# EAGLE design _old (EAGLE 8.0.0)
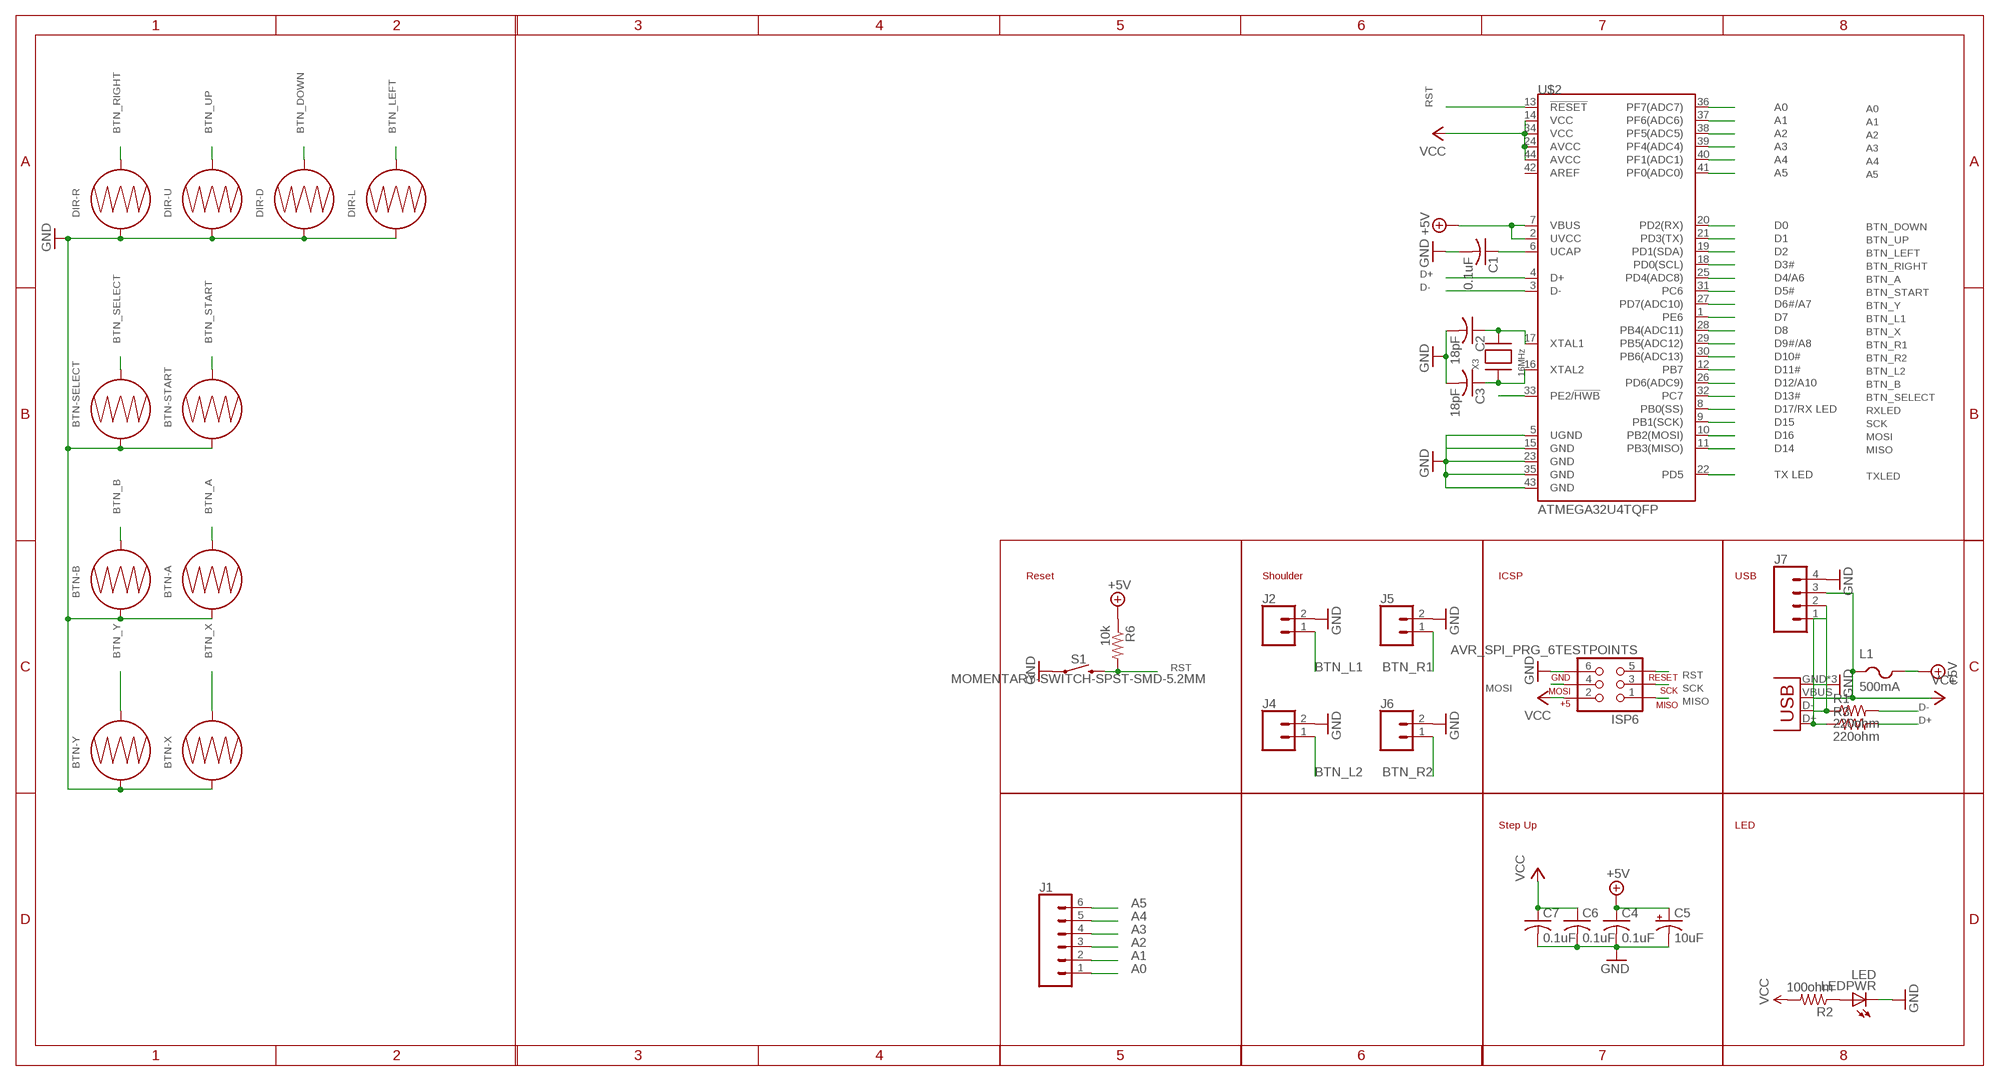
[diagram p0: schematic, sheet 1]

## Parts
BTN-A  BUTTON-CONDUCTIVESMD  [BUTTON-CONDUCTIVE]
BTN-B  BUTTON-CONDUCTIVESMD  [BUTTON-CONDUCTIVE]
BTN-SELECT  BUTTON-CONDUCTIVESMD  [BUTTON-CONDUCTIVE]
BTN-START  BUTTON-CONDUCTIVESMD  [BUTTON-CONDUCTIVE]
BTN-X  BUTTON-CONDUCTIVESMD  [BUTTON-CONDUCTIVE]
BTN-Y  BUTTON-CONDUCTIVESMD  [BUTTON-CONDUCTIVE]
C1  0.1uF  C-USC0805  [C0805]
C2  18pF  C-USC0805  [C0805]
C3  18pF  C-USC0805  [C0805]
C4  0.1uF  C-USC0805  [C0805]
C5  10uF  10UF-TANT  [EIA3216]
C6  0.1uF  C-USC0805  [C0805]
C7  0.1uF  C-USC0805  [C0805]
CN1  USB-MICROB  [USB-MICROB]
DIR-D  BUTTON-CONDUCTIVESMD  [BUTTON-CONDUCTIVE]
DIR-L  BUTTON-CONDUCTIVESMD  [BUTTON-CONDUCTIVE]
DIR-R  BUTTON-CONDUCTIVESMD  [BUTTON-CONDUCTIVE]
DIR-U  BUTTON-CONDUCTIVESMD  [BUTTON-CONDUCTIVE]
ISP6  AVR_SPI_PRG_6TESTPOINTS  [2X3_TEST_POINTS]
J1  CONN_06NO_SILK_FEMALE_PTH  [1X06_NO_SILK]
J2  CONN_021X02_NO_SILK  [1X02_NO_SILK]
J4  CONN_021X02_NO_SILK  [1X02_NO_SILK]
J5  CONN_021X02_NO_SILK  [1X02_NO_SILK]
J6  CONN_021X02_NO_SILK  [1X02_NO_SILK]
J7  CONN_041X04_NO_SILK  [1X04_NO_SILK]
L1  500mA  PTCFUSE-1206  [R1206]
LEDPWR  LED  LEDCHIPLED_0805  [CHIPLED_0805]
R1  220ohm  R-US_R0805  [R0805]
R2  100ohm  R-US_R0805  [R0805]
R3  220ohm  R-US_R0805  [R0805]
R6  10k  R-US_R0805  [R0805]
S1  MOMENTARY-SWITCH-SPST-SMD-5.2MM  [TACTILE_SWITCH_SMD_5.2MM]
U$2  ATMEGA32U4TQFP  [SPARKFUN-DIGITALIC_TQFP44]
X3  16MHz  XTALNX5032  [NX5032]

## Nets
+5V: C4.1 C5.A(+) L1.2 R6.1 U$2.2(UVCC) U$2.7(VBUS)
A0: J1.1 U$2.36(PF7(ADC7))
A1: J1.2 U$2.37(PF6(ADC6))
A2: J1.3 U$2.38(PF5(ADC5))
A3: J1.4 U$2.39(PF4(ADC4))
A4: J1.5 U$2.40(PF1(ADC1))
A5: J1.6 U$2.41(PF0(ADC0))
BTN_A: BTN-A.2 U$2.25(PD4(ADC8))
BTN_B: BTN-B.2 U$2.26(PD6(ADC9))
BTN_DOWN: DIR-D.2 U$2.20(PD2(RX))
BTN_L1: J2.1 U$2.1(PE6)
BTN_L2: J4.1 U$2.12(PB7)
BTN_LEFT: DIR-L.2 U$2.19(PD1(SDA))
BTN_R1: J5.1 U$2.29(PB5(ADC12))
BTN_R2: J6.1 U$2.30(PB6(ADC13))
BTN_RIGHT: DIR-R.2 U$2.18(PD0(SCL))
BTN_SELECT: BTN-SELECT.2 U$2.32(PC7)
BTN_START: BTN-START.2 U$2.31(PC6)
BTN_UP: DIR-U.2 U$2.21(PD3(TX))
BTN_X: BTN-X.2 U$2.28(PB4(ADC11))
BTN_Y: BTN-Y.2 U$2.27(PD7(ADC10))
D+: R3.2 U$2.4(D+)
D+IN: CN1.D+ J7.1 R3.1
D-: R1.2 U$2.3(D-)
D-IN: CN1.D- J7.2 R1.1
GND: BTN-A.1 BTN-B.1 BTN-SELECT.1 BTN-START.1 BTN-X.1 BTN-Y.1 C1.2 C2.2 C3.2 C4.2 C5.C(-) C6.2 C7.2 CN1.GND CN1.MT1(GND) CN1.MT2(GND) DIR-D.1 DIR-L.1 DIR-R.1 DIR-U.1 ISP6.6 J2.2 J4.2 J5.2 J6.2 J7.4 LEDPWR.C S1.1 U$2.5(UGND) U$2.15(GND) U$2.23(GND) U$2.35(GND) U$2.43(GND)
HWB: U$2.33(PE2/!HWB)
MISO: ISP6.1 U$2.11(PB3(MISO))
MOSI: ISP6.4 U$2.10(PB2(MOSI))
N$2: LEDPWR.A R2.1
N$8: C2.1 U$2.17(XTAL1) X3.P$2
N$9: C3.1 U$2.16(XTAL2) X3.P$1
RST: ISP6.5 R6.2 S1.3 U$2.13(!RESET)
RXLED: U$2.8(PB0(SS))
SCK: ISP6.3 U$2.9(PB1(SCK))
TXLED: U$2.22(PD5)
UCAP: C1.1 U$2.6(UCAP)
VCC: C6.1 C7.1 CN1.VBUS ISP6.2 J7.3 L1.1 R2.2 U$2.14(VCC) U$2.24(AVCC) U$2.34(VCC) U$2.44(AVCC)
Unconnected: U$2.42(AREF)

## Notes on the sheet
- Reset | Shoulder | ICSP | USB
- Step Up | LED

## Library data of the parts
BTN-A BTN-B BTN-SELECT BTN-START BTN-X BTN-Y DIR-D DIR-L DIR-R DIR-U = SparkFun-Electromechanical:BUTTON-CONDUCTIVE: Used with rubber key pads. This one was designed and proven to work with the PolyCase Key FOB enclosures.
C1-C4 C6 C7 = adafruit:C-US: CAPACITOR, American symbol
C5 = SparkFun-Retired:10UF-TANT: 10uF Tantalum SMT CAP-00811- 16V 10% (EIA-3216); PROD_ID: CAP-00811
CN1 = SparkFun-Connectors:USB: USB Connectors USB-B-PTH is fully proven SKU : PRT-00139/CONN-08278 USB-miniB is fully proven SKU : PRT-00587 USB-A-PCB is untested. USB-A-H is throughly reviewed, but untested. Spark Fun Electronics SKU : PRT-00437 USB-B-SMT is throughly reviewed, but untested. Needs silkscreen touching up. USB-A-S has not been used/tested USB-MB-H has not been used/tested USB-MICROB has been used. CONN-09505; PROD_ID: CONN-09505
ISP6 = SparkFun-Connectors:AVR_SPI_PRG_6: AVR ISP 6 Pin This is the reduced ISP connector for AVR programming. Common on Arduino. This footprint will take up less PCB space and can be used with a 10-pin to 6-pin adapter such as SKU: BOB-08508 **Special note about "TEST_POINT" package. The stop mask is on the top side, so if you want your programming test points to be on the bottom of your board, make sure to place this package on the bottom side of the board. This also ensure that the orientation to program from the bottom side will be correct.
J1 = SparkFun-Connectors:CONN_06: Multi connection point. Often used as Generic Header-pin footprint for 0.1 inch spaced/style header connections On any of the 0.1 inch spaced packages, you can populate with these: Break Away Headers - Straight <https://www.sparkfun.com/products/116> (PRT-00116) Break Away Male Headers - Right Angle <https://www.sparkfun.com/products/553> (PRT-00553) Female Headers <https://www.sparkfun.com/products/115> (PRT-00115) Break Away Headers - Machine Pin <https://www.sparkfun.com/products/117> (PRT-00117) Break Away Female Headers - Swiss Machine Pin <https://www.sparkfun.com/products/743> (PRT-00743) Arduino Stackable Header - 6 Pin <https://www.sparkfun.com/products/9280> (PRT-09280) For SCREWTERMINALS and SPRING TERMINALS visit here: Screw Terimnals on SparkFun.com <https://www.sparkfun.com/search/results?term=Screw+Terminals> (5mm/3.5mm/2.54mm spacing) This device is also useful as a general connection point to wire up your design to another part of your project. Our various solder wires solder well into these plated through hole pads. Hook-Up Wire - Assortment (Stranded, 22 AWG) <https://www.sparkfun.com/products/11375> (PRT-11375) Hook-Up Wire - Assortment (Solid Core, 22 AWG) <https://www.sparkfun.com/products/11367> (PRT-11367) View the entire wire category on our website here <https://www.sparkfun.com/categories/141>; PROD_ID: CONN-08437
J2 J4-J6 = SparkFun-Connectors:CONN_02: Multi connection point. Often used as Generic Header-pin footprint for 0.1 inch spaced/style header connections On any of the 0.1 inch spaced packages, you can populate with these: Break Away Headers - Straight <https://www.sparkfun.com/products/116> (PRT-00116) Break Away Male Headers - Right Angle <https://www.sparkfun.com/products/553> (PRT-00553) Female Headers <https://www.sparkfun.com/products/115> (PRT-00115) Break Away Headers - Machine Pin <https://www.sparkfun.com/products/117> (PRT-00117) Break Away Female Headers - Swiss Machine Pin <https://www.sparkfun.com/products/743> (PRT-00743) For SCREWTERMINALS and SPRING TERMINALS visit here: Screw Terimnals on SparkFun.com <https://www.sparkfun.com/search/results?term=Screw+Terminals> (5mm/3.5mm/2.54mm spacing) This device is also useful as a general connection point to wire up your design to another part of your project. Our various solder wires solder well into these plated through hole pads. Hook-Up Wire - Assortment (Stranded, 22 AWG) <https://www.sparkfun.com/products/11375> (PRT-11375) Hook-Up Wire - Assortment (Solid Core, 22 AWG) <https://www.sparkfun.com/products/11367> (PRT-11367) View the entire wire category on our website here <https://www.sparkfun.com/categories/141> Special notes: Molex polarized connector foot print use with: PRT-08233 with associated crimp pins and housings. 2.54_SCREWTERM for use with PRT-10571. 3.5mm Screw Terminal footprints for PRT-08084 5mm Screw Terminal footprints for use with PRT-08432
J7 = SparkFun-Connectors:CONN_04: Multi connection point. Often used as Generic Header-pin footprint for 0.1 inch spaced/style header connections On any of the 0.1 inch spaced packages, you can populate with these: Break Away Headers - Straight <https://www.sparkfun.com/products/116> (PRT-00116) Break Away Male Headers - Right Angle <https://www.sparkfun.com/products/553> (PRT-00553) Female Headers <https://www.sparkfun.com/products/115> (PRT-00115) Break Away Headers - Machine Pin <https://www.sparkfun.com/products/117> (PRT-00117) Break Away Female Headers - Swiss Machine Pin <https://www.sparkfun.com/products/743> (PRT-00743) For SCREWTERMINALS and SPRING TERMINALS visit here: Screw Terimnals on SparkFun.com <https://www.sparkfun.com/search/results?term=Screw+Terminals> (5mm/3.5mm/2.54mm spacing) This device is also useful as a general connection point to wire up your design to another part of your project. Our various solder wires solder well into these plated through hole pads. Hook-Up Wire - Assortment (Stranded, 22 AWG) <https://www.sparkfun.com/products/11375> (PRT-11375) Hook-Up Wire - Assortment (Solid Core, 22 AWG) <https://www.sparkfun.com/products/11367> (PRT-11367) View the entire wire category on our website here <https://www.sparkfun.com/categories/141> Special notes: Molex polarized connector foot print use with SKU : PRT-08231 with associated crimp pins and housings. 1MM SMD Version SKU: PRT-10208; PROD_ID: CONN-09696
L1 = adafruit:PTCFUSE: PTC fuses, resettable thermistors
LEDPWR = adafruit:LED: LED OSRAM: - CHIPLED LG R971, LG N971, LY N971, LG Q971, LY Q971, LO R971, LY R971 LH N974, LH R974 LS Q976, LO Q976, LY Q976 LO Q996 - Hyper CHIPLED LW Q18S LB Q993, LB Q99A, LB R99A - SideLED LS A670, LO A670, LY A670, LG A670, LP A670 LB A673, LV A673, LT A673, LW A673 LH A674 LY A675 LS A676, LA A676, LO A676, LY A676, LW A676 LS A679, LY A679, LG A679 - Hyper Micro SIDELED® LS Y876, LA Y876, LO Y876, LY Y876 LT Y87S - SmartLED LW L88C, LW L88S LB L89C, LB L89S, LG L890 LS L89K, LO L89K, LY L89K LS L896, LA L896, LO L896, LY L896 - TOPLED LS T670, LO T670, LY T670, LG T670, LP T670 LSG T670, LSP T670, LSY T670, LOP T670, LYG T670 LG T671, LOG T671, LSG T671 LB T673, LV T673, LT T673, LW T673 LH T674 LS T676, LA T676, LO T676, LY T676, LB T676, LH T676, LSB T676, LW T676 LB T67C, LV T67C, LT T67C, LS T67K, LO T67K, LY T67K, LW E67C LS E67B, LA E67B, LO E67B, LY E67B, LB E67C, LV E67C, LT E67C LW T67C LS T679, LY T679, LG T679 LS T770, LO T770, LY T770, LG T770, LP T770 LB T773, LV T773, LT T773, LW T773 LH T774 LS E675, LA E675, LY E675, LS T675 LS T776, LA T776, LO T776, LY T776, LB T776 LHGB T686 LT T68C, LB T68C - Hyper Mini TOPLED® LB M676 - Mini TOPLED Santana® LG M470 LS M47K, LO M47K, LY M47K Source: http://www.osram.convergy.de/
R1-R3 R6 = adafruit:R-US_: RESISTOR, American symbol
S1 = SparkFun-Switches:MOMENTARY-SWITCH-SPST: Momentary Switch (Pushbutton) - SPST Normally-open (NO) SPST momentary switches (buttons, pushbuttons). Variants PTH-12MM - 12mm square, through-hole Momentary Pushbutton Switch - 12mm Square <https://www.sparkfun.com/products/9190> (COM-09190) PTH-6.0MM, PTH-6.0MM-KIT - 6.0mm square, through-hole Mini Pushbutton Switch <https://www.sparkfun.com/products/97> (COM-00097) KIT package intended for soldering kit's - only one side of pads' copper is exposed. PTH-RIGHT-ANGLE-KIT - Right-angle, through-hole Right Angle Tactile Button <https://www.sparkfun.com/products/10791> - Used on SparkFun BigTime Watch Kit <https://www.sparkfun.com/products/11734> SMD-12MM - 12mm square, surface-mount Tactile Button - SMD (12mm) <https://www.sparkfun.com/products/12993> (COM-12993) Used on SparkFun PicoBoard <https://www.sparkfun.com/products/11888> SMD-4.5MM - 4.5mm Square Trackball Switch Used on SparkFun Blackberry Trackballer Breakout <https://www.sparkfun.com/products/13169> SMD-4.6MMX2.8MM - 4.60mm x 2.80mm, surface mount Used on SparkFun SAMD21 Mini Breakout <https://www.sparkfun.com/products/13664> SMD-5.2MM, SMD-5.2-REDUNDANT - 5.2mm square, surface-mount Mini Pushbutton Switch - SMD <https://www.sparkfun.com/products/8720> (COM-08720) Used on Arduino Pro Mini <https://www.sparkfun.com/products/11114> REDUNDANT package connects both switch circuits together SMD-6.0X3.5MM - 6.0 x 3.5mm, surface mount Momentary Reset Switch SMD <https://www.sparkfun.com/products/8229> (COM-08229) SMD-6.2MM-TALL - 6.2mm square, surface mount Tactile Button - SMD (6mm) <https://www.sparkfun.com/products/12992> Used on SparkFun Digital Sandbox <https://www.sparkfun.com/products/12651> SMD-RIGHT-ANGLE - Right-angle, surface mount Used on SparkFun Block for Intel® Edison - Arduino <https://www.sparkfun.com/products/13036>; PROD_ID: SWCH-08247; SF_SKU: COM-08720
U$2 = SparkFun-Retired:ATMEGA32U4: Atmel 44-pin 8-bit Microcontroller with 32KBytes of ISP Flash and USB Controller ----- Please use the QFN-44-NOPAD_1:1 package for the footprint of all boards using a 32U4. Route traces directly away from the pads as much as possible.; PROD_ID: IC-11161
X3 = adaprog:XTAL

## Board
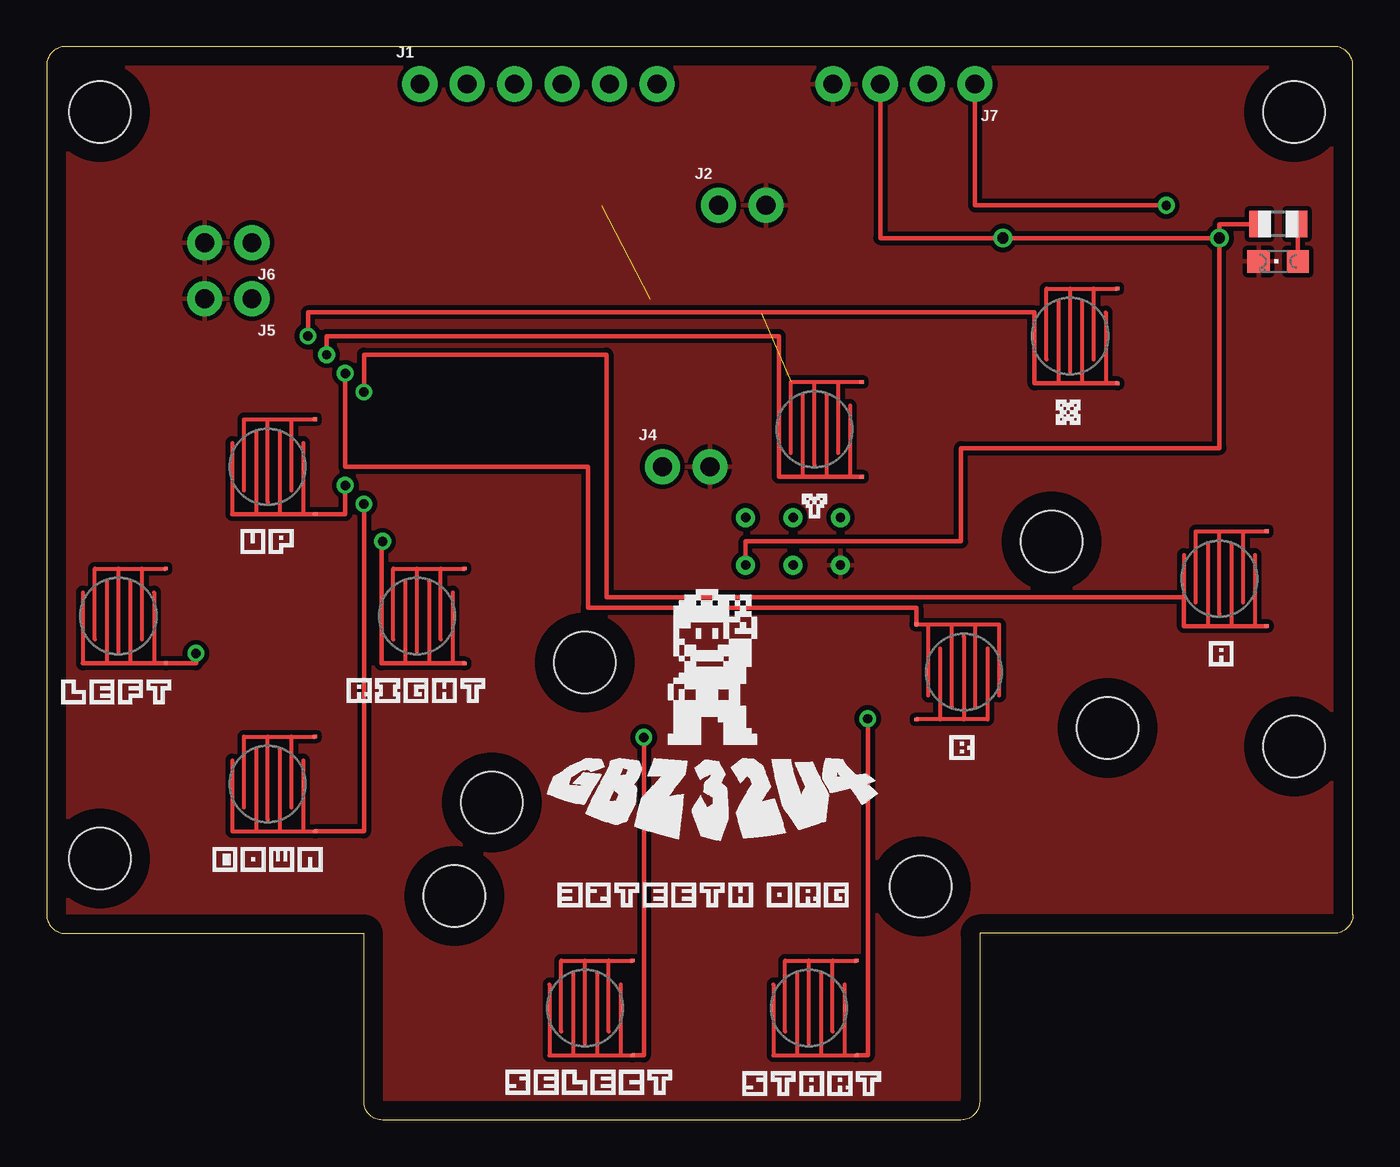
[diagram p1: board, top side]
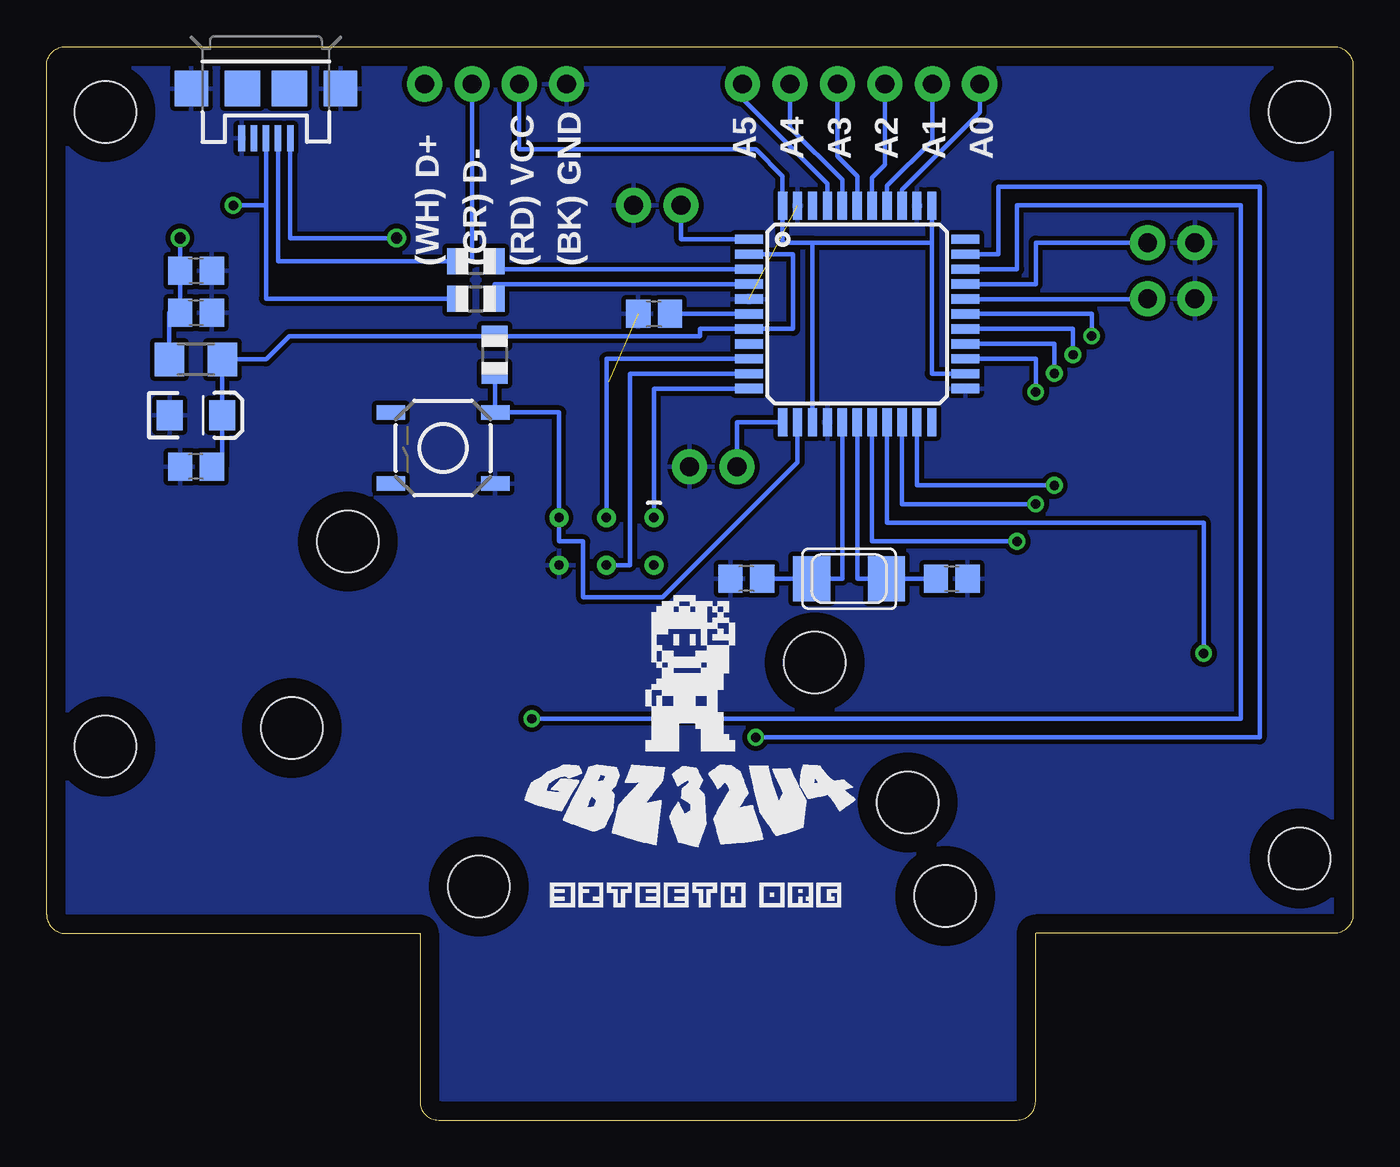
[diagram p2: board, bottom side, seen from below]

Size 70 x 57.5 mm. Coordinates in mm from the lower left corner, seen from the top.
Outline: 70,11 70,56.5 arc90 69,57.5 1,57.5 arc90 0,56.5 0,11 arc90 1,10 17,10 17,1 arc90 18,0 49,0 arc90 50,1 50,10 69,10 arc90 70,11
Copper layers (1*16): Top 0.035mm / dielectric 1.5mm / Bottom 0.035mm
Design rules "default *": minimum track width 10mil, minimum drill 20mil, track to track 10mil, track to pad 10mil, pad to pad 10mil, via to via 10mil, smd to smd 10mil, copper to edge 40mil, drill to drill 20mil, minimum pad ring 10mil, minimum via ring 8mil, stop-mask expansion 4mil, vias tented up to drill 20mil, thermal gap 10mil

### Footprints (pad centres in the part's own frame; a part is rotated, then mirrored left to right if it is on the bottom)
BUTTON-CONDUCTIVE = smd 0.203 x 0.203: 1 2.54,2.54; 2 2.54,-2.54
C0805 = smd 1.3 x 1.5: 1 -0.85,0; 2 0.85,0
EIA3216 = smd 1.4 x 1.6: A 1.4,0; C -1.4,0
USB-MICROB = smd 0.35 x 1.4: D+ 0,2.65; D- -0.65,2.65; GND 1.3,2.65; ID 0.65,2.65; VBUS -1.3,2.65 | smd 1.8 x 1.9: MT1 -4,0; MT2 4,0 | smd 1.9 x 1.9: P$1 -1.27,0; P$2 1.27,0
2X3_TEST_POINTS = drill 0.508: 1 -2.54,-1.27; 2 -2.54,1.27; 3 0,-1.27; 4 0,1.27; 5 2.54,-1.27; 6 2.54,1.27
1X06_NO_SILK = drill 1.016 pad 1.88: 1 0,0; 2 2.54,0; 3 5.08,0; 4 7.62,0; 5 10.16,0; 6 12.7,0
1X02_NO_SILK = drill 1.016 pad 1.88: 1 0,0; 2 2.54,0
1X04_NO_SILK = drill 1.016 pad 1.88: 1 0,0; 2 2.54,0; 3 5.08,0; 4 7.62,0
R1206 = smd 1.6 x 1.803: 1 -1.422,0; 2 1.422,0
CHIPLED_0805 = smd 1.2 x 1.2: A 0,-1.05; C 0,1.05
R0805 = smd 1.1 x 1.4: 1 -1,0; 2 1,0
TACTILE_SWITCH_SMD_5.2MM = smd 1.524 x 0.762: 1 -2.794,1.905; 2 2.794,1.905; 3 -2.794,-1.905; 4 2.794,-1.905
SPARKFUN-DIGITALIC_TQFP44 = smd 1.5 x 0.5: 1 -5.8,4; 2 -5.8,3.2; 3 -5.8,2.4; 4 -5.8,1.6; 5 -5.8,0.8; 6 -5.8,0; 7 -5.8,-0.8; 8 -5.8,-1.6; 9 -5.8,-2.4; 10 -5.8,-3.2; 11 -5.8,-4; 23 5.8,-4; 24 5.8,-3.2; 25 5.8,-2.4; 26 5.8,-1.6; 27 5.8,-0.8; 28 5.8,0; 29 5.8,0.8; 30 5.8,1.6; 31 5.8,2.4; 32 5.8,3.2; 33 5.8,4 | smd 0.5 x 1.5: 12 -4,-5.8; 13 -3.2,-5.8; 14 -2.4,-5.8; 15 -1.6,-5.8; 16 -0.8,-5.8; 17 0,-5.8; 18 0.8,-5.8; 19 1.6,-5.8; 20 2.4,-5.8; 21 3.2,-5.8; 22 4,-5.8; 34 4,5.8; 35 3.2,5.8; 36 2.4,5.8; 37 1.6,5.8; 38 0.8,5.8; 39 0,5.8; 40 -0.8,5.8; 41 -1.6,5.8; 42 -2.4,5.8; 43 -3.2,5.8; 44 -4,5.8
STAND-OFF = hole 3.302: 0,0
NX5032 = smd 2 x 2.4: P$1 2,0; P$2 -2,0

### Placement (x,y rotation side)
BTN-A  62.85,29 0 top
BTN-B  49.15,24 180 top
BTN-SELECT  28.85,6 0 top
BTN-START  40.85,6 0 top
BTN-X  54.85,42 0 top
BTN-Y  41.15,37 0 top
C1  37.45,43.18 180 bottom
C2  21.5,29 0 bottom
C3  32.5,29 180 bottom
C4  62,35 180 bottom
C5  62,37.75 0 bottom
C6  62,43.25 0 bottom
C7  62,45.5 0 bottom
CN1  58.25,55.25 180 bottom
DIR-D  11.85,18 0 top
DIR-L  3.85,27 0 top
DIR-R  19.85,27 0 top
DIR-U  11.85,35 0 top
ISP6  40,31 180 bottom
J1  20,55.5 0 top
J2  36,49 0 top
J4  33,35 0 top
J5  11,44 180 top
J6  11,47 180 top
J7  49.75,55.5 180 top
L1  62,40.75 0 bottom
LEDPWR  66,46 90 top
R1  47,46 0 bottom
R2  66,48 180 top
R3  47,44 0 bottom
R6  46,41 270 bottom
S1  48.75,36 180 bottom
U$2  26.56,43.18 0 bottom
U$3  [STAND-OFF]  2.85,14 90 top
U$4  [STAND-OFF]  46.85,12.5 90 top
U$5  [STAND-OFF]  66.85,20 90 top
U$6  [STAND-OFF]  28.85,24.5 90 top
U$7  [STAND-OFF]  23.85,17 90 top
U$8  [STAND-OFF]  2.85,54 90 top
U$9  [STAND-OFF]  56.85,21 90 top
U$10  [STAND-OFF]  21.85,12 90 top
U$11  [STAND-OFF]  53.85,31 90 top
U$12  [STAND-OFF]  66.85,54 90 top
X3  27,29 180 bottom

### Tracks (layer width: path | path; a pad name or v marks a point on that pad's centre or on a via)
+5V
  Bottom 0.254: C4.1 60.6,35 C5.A 60.6,40.75 L1.2 58.25,40.75 57,42 R6.1 35,42 35,42.38 U$2.7 30,42.38 30,46.38 U$2.2
A0
  Bottom 0.254: U$2.36 24.16,49.84 20,54 J1.1
A1
  Bottom 0.254: U$2.37 24.96,50.04 22.54,52.46 J1.2
A2
  Bottom 0.254: U$2.38 25.76,50.49 25.08,51.17 J1.3
A3
  Bottom 0.254: U$2.39 26.56,50.56 27.62,51.62 J1.4
A4
  Bottom 0.254: U$2.40 27.36,50.36 30.16,53.16 J1.5
A5
  Bottom 0.254: U$2.41 28.16,50.16 32.7,54.7 J1.6
BTN_A  (via drill 0.5)
  Top 0.254: v17,39 17,41 30,41 30,28 60.95,28 60.95,26.46 BTN-A.2
  Bottom 0.254: U$2.25 17,40.78 v17,39
BTN_B  (via drill 0.5)
  Top 0.254: v16,40 16,35 29,35 29,27.45 46.61,27.45 BTN-B.2
  Bottom 0.254: U$2.26 16,41.58 v16,40
BTN_DOWN  (via drill 0.5)
  Top 0.254: v17,33 17,15.46 DIR-D.2
  Bottom 0.254: U$2.20 24.16,33 v17,33
BTN_L1
  Bottom 0.254: U$2.1 36,47.18 J2.1
BTN_L2
  Bottom 0.254: U$2.12 33,37.38 J4.1
BTN_LEFT  (via drill 0.5)
  Top 0.254: 1.95,24.46 DIR-L.2 8,24.46 v8,25
  Bottom 0.254: U$2.19 24.96,32 8,32 v8,25
BTN_R1
  Bottom 0.254: U$2.29 11,43.98 J5.1
BTN_R2
  Bottom 0.254: U$2.30 17,44.78 17,47 J6.1
BTN_RIGHT  (via drill 0.5)
  Top 0.254: v18,31 17.95,31 17.95,24.46 DIR-R.2
  Bottom 0.254: U$2.18 25.76,31 v18,31
BTN_SELECT  (via drill 0.5)
  Top 0.254: v32,20.5 32,3.46 BTN-SELECT.2
  Bottom 0.254: U$2.32 19,46.38 19,50 5,50 5,20.5 v32,20.5
BTN_START  (via drill 0.5)
  Top 0.254: v44,21.5 44,3.46 BTN-START.2
  Bottom 0.254: U$2.31 18,45.58 18,49 6,49 6,21.5 v44,21.5
BTN_UP  (via drill 0.5)
  Top 0.254: 9.95,32.46 DIR-U.2 16,32.46 v16,34
  Bottom 0.254: U$2.21 23.36,34 v16,34
BTN_X  (via drill 0.5)
  Top 0.254: v14,42 14,43.27 52.95,43.27 52.95,39.46 BTN-X.2
  Bottom 0.254: U$2.28 14,43.18 v14,42
BTN_Y  (via drill 0.5)
  Top 0.254: v15,41 15,42 39.24,42 39.24,34.46 BTN-Y.2
  Bottom 0.254: U$2.27 15,42.38 v15,41
D+
  Bottom 0.254: R3.2 46,44.78 U$2.4
D+IN  (via drill 0.5)
  Top 0.254: J7.1 49.75,49 v60,49
  Bottom 0.254: 57,44 R3.1 | 57,44 57.28,44 | 58.25,49 CN1.D+ | 58.25,49 58.25,44 57,44 | v60,49 58.25,49
D-
  Bottom 0.254: R1.2 46,45.58 U$2.3
D-IN
  Bottom 0.254: J7.2 47.21,46 R1.1 57.6,46 CN1.D-
GND  (2 unrouted)
  pour Bottom: 0,57.5 70,57.5 70,10 50,10 50,0 17,0 17,10 0,10
  pour Top: 0,57.5 70,57.5 70,10 50,10 50,0 17,0 17,10 0,10
MISO
  Bottom 0.254: ISP6.1 37.46,39.18 U$2.11
MOSI
  Bottom 0.254: U$2.10 38.75,39.98 38.75,29.73 ISP6.4
N$2
  Top 0.254: R2.1 67.05,48 LEDPWR.A
N$8
  Bottom 0.254: C2.1 X3.P$2 26.56,29 U$2.17
N$9
  Bottom 0.254: C3.1 X3.P$1 27.36,29 U$2.16
RST
  Bottom 0.254: R6.2 45.96,40 S1.3 42.54,37.91 ISP6.5 42.54,31 41.25,31 41.25,28 37,28 29.76,35.24 U$2.13
SCK
  Bottom 0.254: U$2.9 40,40.78 ISP6.3
UCAP
  Bottom 0.254: C1.1 U$2.6
VCC  (via drill 0.6)
  Top 0.254: J7.3 44.67,47.25 v51.25,47.25 v62.85,47.25 | R2.2 62.85,48 v62.85,47.25 | ISP6.2 37.46,31 49,31 49,36 62.85,36 v62.85,47.25
  Bottom 0.254: v62.85,47.25 C7.1 C6.1 63.42,43.25 L1.1 | U$2.34 22.56,47 | 28.96,47 30.56,47 U$2.44 30.56,50.56 32,52 44.67,52 J7.3 | 28.96,47 22.56,47 | 22.56,47 22.56,39.98 U$2.24 | U$2.14 28.96,47 | CN1.VBUS 56.95,47.25 v51.25,47.25

### Text on the board
bPlace: A5 / A4 / A3 / A2 / A1 / A0 | (WH) D+ / (GR) D- / (RD) VCC / (BK) GND